# EAGLE design realtalker (EAGLE 7.1.0)
COMPANY_NAME: Mark J. Blair, NF6X; DOCUMENT_ID: CoCoEPROMpak_v1.0; REV: 1.0
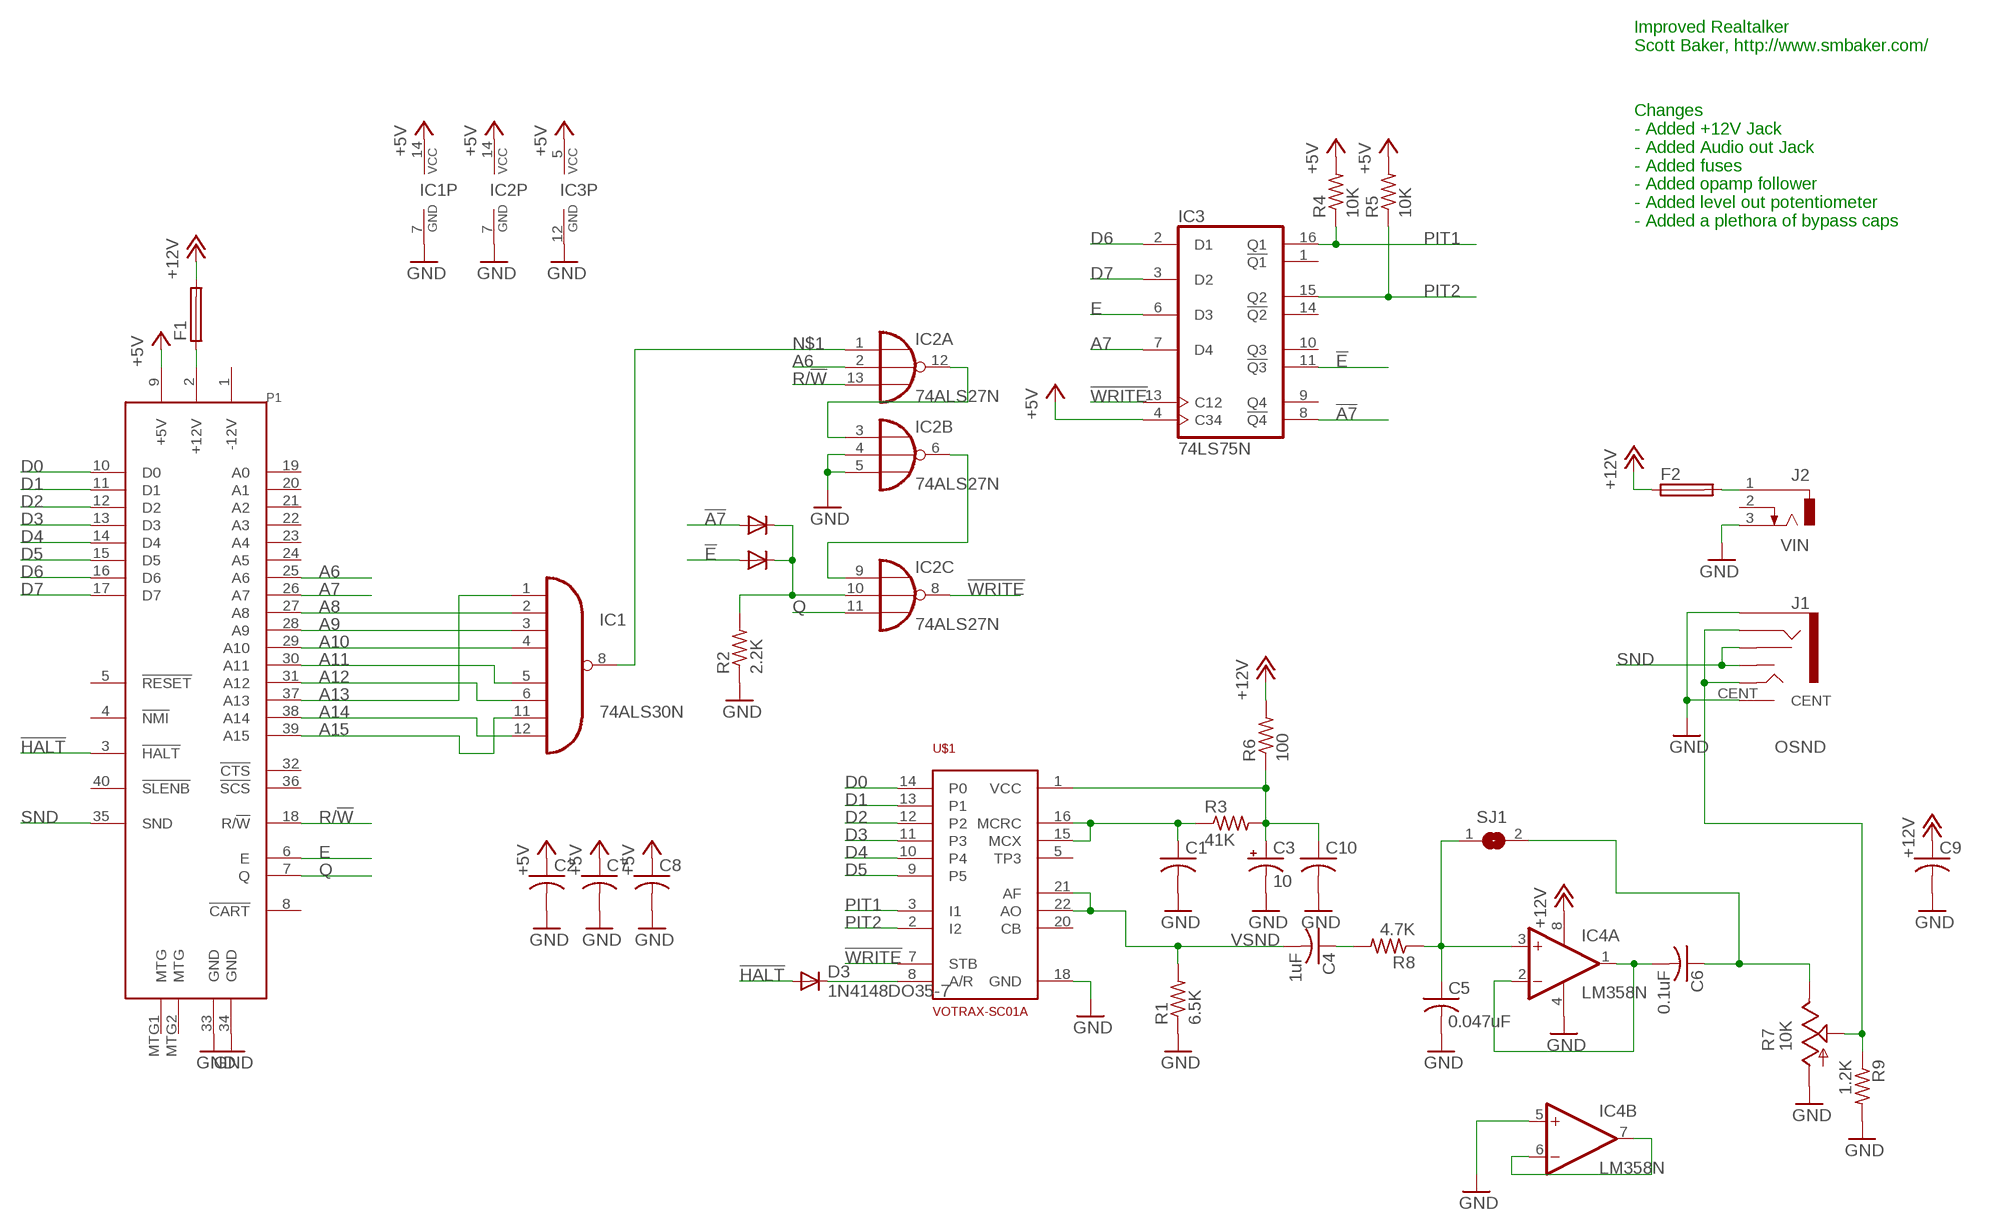
[diagram p0: schematic, sheet 1]

## Parts
C1  C-US025-025X050  [C025-025X050]
C2  C-US025-025X050  [C025-025X050]
C3  10  CPOL-USE2.5-6  [E2,5-6]
C4  1uF  C-US025-025X050  [C025-025X050]
C5  0.047uF  C-US025-025X050  [C025-025X050]
C6  0.1uF  C-US025-025X050  [C025-025X050]
C7  C-US025-025X050  [C025-025X050]
C8  C-US025-025X050  [C025-025X050]
C9  C-US025-025X050  [C025-025X050]
C10  C-US025-025X050  [C025-025X050]
D1  1N4148DO35-7  [DO35-7]
D2  1N4148DO35-7  [DO35-7]
D3  1N4148DO35-7  [DO35-7]
F1  PTC_FUSE  [PTC_0.400]
F2  PTC_FUSE  [PTC_0.400]
IC1  74ALS30N  [DIL14]
IC2  74ALS27N  [DIL14]
IC3  74LS75N  [DIL16]
IC4  LM358N  [DIL08]
J1  AUDIO_JACK_3.5MM  [AUDIO-JACK-G]
J2  VIN  DCJACK  [DCJACK]
P1  COCO-CARTMED  [COCO-CART_MEDIUM]
R1  6.5K  R-US_0204/7  [0204/7]
R2  2.2K  R-US_0204/7  [0204/7]
R3  41K  R-US_0204/7  [0204/7]
R4  10K  R-US_0204/7  [0204/7]
R5  10K  R-US_0204/7  [0204/7]
R6  100  R-US_0204/7  [0204/7]
R7  10K  TRIM_US-CT6  [CT6]
R8  4.7K  R-US_0204/7  [0204/7]
R9  1.2K  R-US_0204/7  [0204/7]
SJ1  SJ  [SJ]
U$1  VOTRAX-SC01A  [DIL22-4]

## Nets
!A7: D2.A IC3.8(!Q4)
!E: D1.A IC3.11(!Q3)
!HALT: D3.A P1.3(!HALT)
!WRITE: IC2.8(C:O) IC3.13(C12) U$1.7(STB)
+5V: C2.1 C7.1 C8.1 IC1.14(VCC) IC2.14(P:VCC) IC3.4(C34) IC3.5(VCC) P1.9(+5V) R4.2 R5.2
+12V [PWR]: C9.1 F1.2 F2.1 IC4.8(P:V+) R6.2
A6: IC2.2(A:I1) P1.25(A6)
A7: IC3.7(D4) P1.26(A7)
A8: IC1.2(I1) P1.27(A8)
A9: IC1.3(I2) P1.28(A9)
A10: IC1.4(I3) P1.29(A10)
A11: IC1.5(I4) P1.30(A11)
A12: IC1.6(I5) P1.31(A12)
A13: IC1.1(I0) P1.37(A13)
A14: IC1.12(I7) P1.38(A14)
A15: IC1.11(I6) P1.39(A15)
D0: P1.10(D0) U$1.14(P0)
D1: P1.11(D1) U$1.13(P1)
D2: P1.12(D2) U$1.12(P2)
D3: P1.13(D3) U$1.11(P3)
D4: P1.14(D4) U$1.10(P4)
D5: P1.15(D5) U$1.9(P5)
D6: IC3.2(D1) P1.16(D6)
D7: IC3.3(D2) P1.17(D7)
E: IC3.6(D3) P1.6(E)
GND [PWR]: C1.2 C2.2 C3.- C5.2 C7.2 C8.2 C9.2 C10.2 IC1.7(GND) IC2.4(B:I1) IC2.5(B:I2) IC2.7(P:GND) IC3.12(GND) IC4.4(P:V-) IC4.5(B:+IN) J1.CENT J1.SLEEVE J2.3 P1.33(GND) P1.34(GND) R1.1 R2.1 R7.A R9.2 U$1.18(GND)
N$1: IC1.8(O) IC2.1(A:I0)
N$2: D3.C U$1.8(A/R)
N$3: C1.1 R3.1 U$1.15(MCX) U$1.16(MCRC)
N$4: C5.1 IC4.3(A:+IN) R8.1 SJ1.1
N$5 [PWR]: C3.+ C10.1 R3.2 R6.1 U$1.1(VCC)
N$6: IC2.3(B:I0) IC2.12(A:O)
N$7: IC2.6(B:O) IC2.9(C:I0)
N$8: D1.C D2.C IC2.10(C:I1) R2.2
N$9: C4.1 R8.2
N$10: IC4.6(B:-IN) IC4.7(B:OUT)
N$11: C6.1 R7.E SJ1.2
N$12 [PWR]: F2.2 J2.1
N$13 [PWR]: F1.1 P1.2(+12V)
N$49: C6.2 IC4.1(A:OUT) IC4.2(A:-IN)
OSND: J1.RING J1.TIP R7.S R9.1
PIT1: IC3.16(Q1) R4.1 U$1.3(I1)
PIT2: IC3.15(Q2) R5.1 U$1.2(I2)
Q: IC2.11(C:I2) P1.7(Q)
R/!W: IC2.13(A:I2) P1.18(R/!W)
SND: J1.RSH J1.TSH P1.35(SND)
VSND: C4.2 R1.2 U$1.21(AF) U$1.22(AO)
Unconnected: IC3.1(!Q1) IC3.9(Q4) IC3.10(Q3) IC3.14(!Q2) J2.2 P1.1(-12V) P1.4(!NMI) P1.5(!RESET) P1.8(!CART) P1.19(A0) P1.20(A1) P1.21(A2) P1.22(A3) P1.23(A4) P1.24(A5) P1.32(!CTS) P1.36(!SCS) P1.40(!SLENB) P1.MTG1(MTG) P1.MTG2(MTG) U$1.5(TP3) U$1.20(CB)

## Notes on the sheet
- Improved Realtalker
  Scott Baker, http://www.smbaker.com/
- Changes
  - Added +12V Jack
  - Added Audio out Jack
  - Added fuses
  - Added opamp follower
  - Added level out potentiometer
  - Added a plethora of bypass caps

## Library data of the parts
C1 C2 C4-C10 = resistor:C-US: CAPACITOR, American symbol
C3 = resistor:CPOL-US: POLARIZED CAPACITOR, American symbol
D1-D3 = diode:1N4148: DIODE high speed (Philips)
F1 F2 = scott:PTC_FUSE: PICOFUSE 19275, Wickmann; OC_FARNELL: unknown; OC_NEWARK: unknown
IC1 = 74xx-eu:74*30: 8-input NAND gate
IC2 = 74xx-eu:74*27: Triple 3-input NOR gate
IC3 = 74xx-eu:74*75: 4-bit bistable LATCH
IC4 = linear:LM358: OP AMP also LM158; LM258; LM2904 Source: http://cache.national.com/ds/LM/LM158.pdf
J1 = scott:AUDIO_JACK_3.5MM: Audio Jack 3.5mm variants of PTH and SMT stereo audio jack with bypass switches. SparkFun Products: SparkFun SparkPunk Sound Kit <[https://www.sparkfun.com/products/11177]> - PTH MP3 Trigger <https://www.sparkfun.com/products/13720> -3.5mm SMD SparkFun PicoBoard <https://www.sparkfun.com/products/11888>- 2.5mm SMD
J2 = scott:DCJACK: DC POWER JACK Source: DCJ0202.pdf
P1 = scott:COCO-CART: Tandy/TRS-80 Color Computer Cartridge Connector
R1-R6 R8 R9 = resistor:R-US_: RESISTOR, American symbol
R7 = pot:TRIM_US-: POTENTIOMETER
SJ1 = jumper:SJ: SMD solder JUMPER
U$1 = scott:VOTRAX-SC01A

## Net classes
0 default: width 0.254 mm, drill 0.254 mm
1 PWR: width 0.406 mm, clearance 0.254 mm

## Board
CoCoEPROMpak 4k-64k EPROM-based ROM cartridge for the Tandy/TRS-80 Color Computer. Copyright 2013 Mark J. Blair Distributed under GPLv3 https://github.com/NF6X/CoCoEPROMpak CoCoEPROMpak is a free hardware design: you can redistribute it and/or modify it under the terms of the GNU General Public License as published by the Free Software Foundation, either version 3 of the License, or (at your option) any later version. CoCoEPROMpak is distributed in the hope that it will be useful, but WITHOUT ANY WARRANTY; without even the implied warranty of MERCHANTABILITY or FITNESS FOR A PARTICULAR PURPOSE. See the GNU General Public License for more details. You should have received a copy of the GNU General Public License along with CoCoEPROMpak. If not, see .
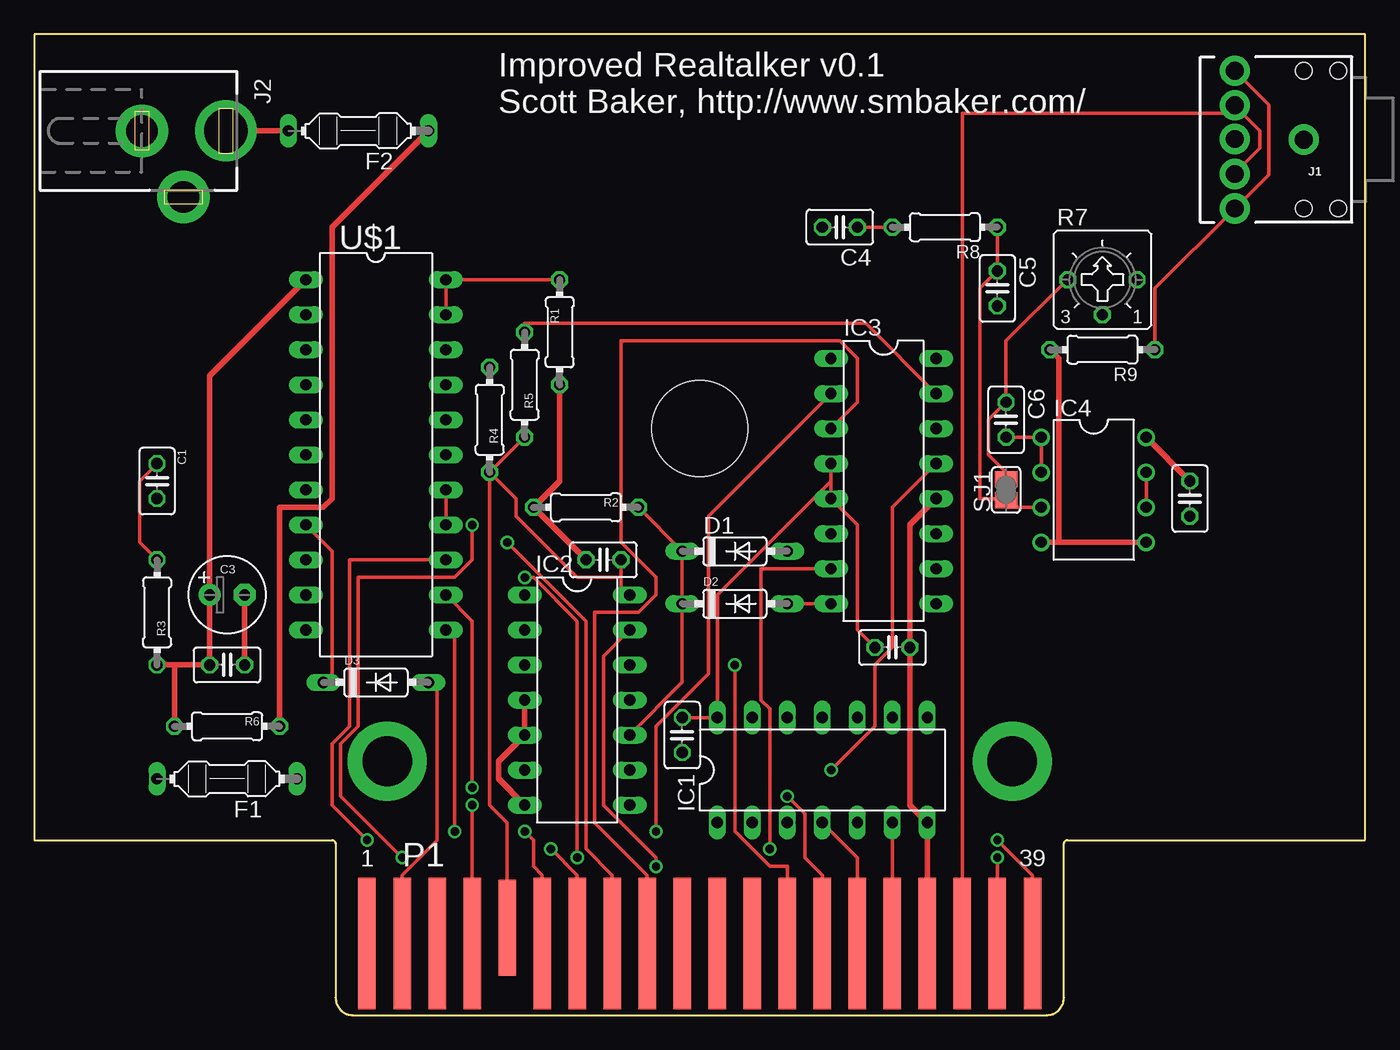
[diagram p1: board, top side]
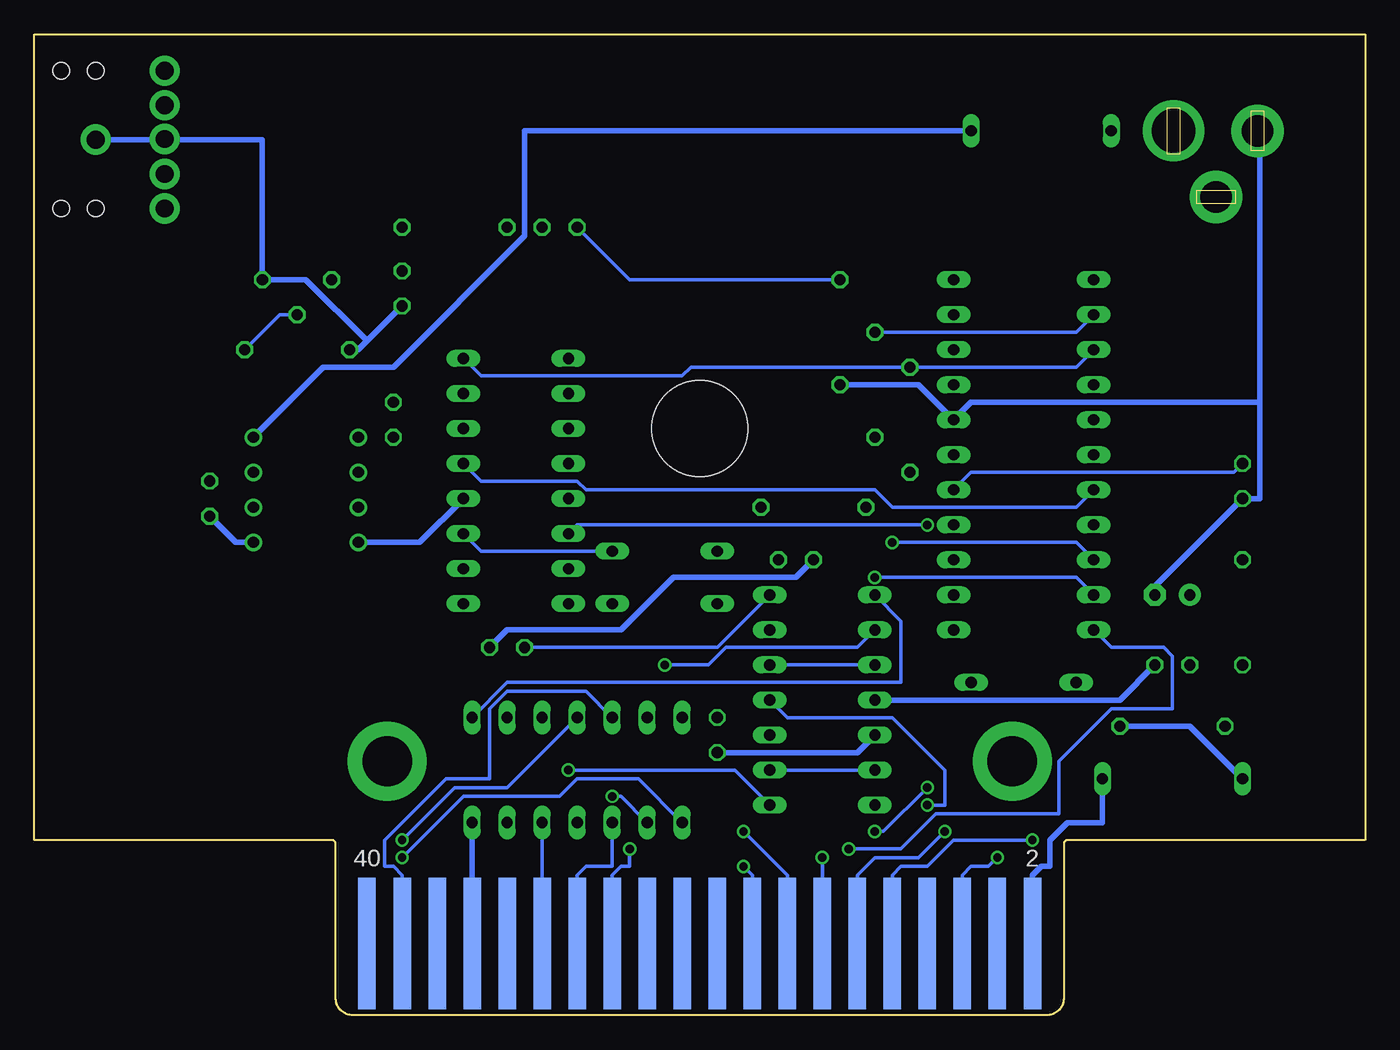
[diagram p2: board, bottom side, seen from below]

Size 96.52 x 71.12 mm. Coordinates in mm from the lower left corner, seen from the top.
Copper layers (1*16): Top 0.0356mm / dielectric 1.5011mm / Bottom 0.0356mm
Design rules "LaenPCBOrder *": minimum track width 10mil, minimum drill 24mil, track to track 6mil, track to pad 6mil, pad to pad 6mil, via to via 6mil, smd to smd 6mil, copper to edge 15mil, drill to drill 6mil, minimum pad ring 7mil, minimum via ring 7mil, stop-mask expansion 3mil, vias tented up to drill 25mil, thermal gap 10mil

### Footprints (pad centres in the part's own frame; a part is rotated, then mirrored left to right if it is on the bottom)
C025-025X050 = drill 0.813 octagon: 1 -1.27,0; 2 1.27,0
E2,5-6 = drill 0.813 pad 1.6: + -1.27,0 | drill 0.813 pad 1.6 octagon: - 1.27,0
DO35-7 = drill 0.813 long: A 3.81,0; C -3.81,0
PTC_0.400 = drill 0.813 long: 1 -5.08,0; 2 5.08,0
DIL14 = drill 0.813 long: 1 -7.62,-3.81; 2 -5.08,-3.81; 3 -2.54,-3.81; 4 0,-3.81; 5 2.54,-3.81; 6 5.08,-3.81; 7 7.62,-3.81; 8 7.62,3.81; 9 5.08,3.81; 10 2.54,3.81; 11 0,3.81; 12 -2.54,3.81; 13 -5.08,3.81; 14 -7.62,3.81
DIL16 = drill 0.813 long: 1 -8.89,-3.81; 2 -6.35,-3.81; 3 -3.81,-3.81; 4 -1.27,-3.81; 5 1.27,-3.81; 6 3.81,-3.81; 7 6.35,-3.81; 8 8.89,-3.81; 9 8.89,3.81; 10 6.35,3.81; 11 3.81,3.81; 12 1.27,3.81; 13 -1.27,3.81; 14 -3.81,3.81; 15 -6.35,3.81; 16 -8.89,3.81
DIL08 = drill 0.813 pad 1.27: 1 -3.81,-3.81; 2 -1.27,-3.81; 3 1.27,-3.81; 4 3.81,-3.81; 5 3.81,3.81; 6 1.27,3.81; 7 -1.27,3.81; 8 -3.81,3.81
AUDIO-JACK-G = drill 1.3 pad 2.184: CENT 5,-0.04; RING 5,5; RSH 5,2.5; SLEEVE 0,0; TIP 5,-5; TSH 5,-2.5 | hole 1.2: 0,5; -2.5,5; -2.5,-5; 0,-5
DCJACK = drill 3.175 pad 4.445: 1 0,3.1 | drill 2.286 pad 3.81: 2 4.8,0; 3 0,-3
COCO-CART_MEDIUM = smd 1.27 x 9.525: 1 -24.13,5.207; 3 -21.59,5.207; 5 -19.05,5.207; 7 -16.51,5.207; 11 -11.43,5.207; 13 -8.89,5.207; 15 -6.35,5.207; 17 -3.81,5.207; 19 -1.27,5.207; 21 1.27,5.207; 23 3.81,5.207; 25 6.35,5.207; 27 8.89,5.207; 29 11.43,5.207; 31 13.97,5.207; 33 16.51,5.207; 35 19.05,5.207; 37 21.59,5.207; 39 24.13,5.207 | smd 1.27 x 9.525 bottom: 2 -24.13,5.207; 4 -21.59,5.207; 6 -19.05,5.207; 8 -16.51,5.207; 10 -13.97,5.207; 12 -11.43,5.207; 14 -8.89,5.207; 16 -6.35,5.207; 18 -3.81,5.207; 20 -1.27,5.207; 22 1.27,5.207; 24 3.81,5.207; 26 6.35,5.207; 28 8.89,5.207; 30 11.43,5.207; 32 13.97,5.207; 34 16.51,5.207; 36 19.05,5.207; 38 21.59,5.207; 40 24.13,5.207 | smd 1.27 x 6.985: 9 -13.97,6.35 | drill 3.607 pad 5.715: MTG1 -22.669,18.415; MTG2 22.669,18.415 | hole 6.985: 0,42.545
0204/7 = drill 0.813 octagon: 1 -3.81,0; 2 3.81,0
CT6 = drill 0.813 octagon: A 2.515,0; E -2.515,0; S 0,-2.54
SJ = smd 1.168 x 1.6: 1 -0.762,0; 2 0.762,0
DIL22-4 = drill 0.813 long: 1 -12.7,-5.08; 2 -10.16,-5.08; 3 -7.62,-5.08; 4 -5.08,-5.08; 5 -2.54,-5.08; 6 0,-5.08; 7 2.54,-5.08; 8 5.08,-5.08; 9 7.62,-5.08; 10 10.16,-5.08; 11 12.7,-5.08; 12 12.7,5.08; 13 10.16,5.08; 14 7.62,5.08; 15 5.08,5.08; 16 2.54,5.08; 17 0,5.08; 18 -2.54,5.08; 19 -5.08,5.08; 20 -7.62,5.08; 21 -10.16,5.08; 22 -12.7,5.08

### Placement (x,y rotation side)
C1  8.89,38.73 270 top
C2  62.23,26.67 0 top
C3  13.97,30.48 0 top
C4  58.42,57.15 180 top
C5  69.85,52.7 270 top
C6  70.48,43.18 270 top
C7  41.27,33.02 180 top
C8  46.99,20.32 270 top
C9  83.82,37.47 270 top
C10  13.97,25.4 0 top
D1  50.8,33.66 0 top
D2  50.8,29.84 0 top
D3  24.76,24.13 0 top
F1  13.97,17.14 180 top
F2  23.49,64.14 180 top
IC1  57.15,17.78 0 top
IC2  39.37,22.86 270 top
IC3  61.59,38.73 270 top
IC4  76.84,38.1 270 top
J1  92.07,63.5 180 top
J2  10.79,64.14 270 top
P1  48.26,0 0 top
R1  38.1,49.53 90 top
R2  40,36.83 0 top
R3  8.89,29.21 270 top
R4  33.02,43.18 270 top
R5  35.56,45.72 270 top
R6  13.97,20.95 0 top
R7  77.47,53.34 0 top
R8  66.04,57.15 180 top
R9  77.47,48.26 180 top
SJ1  70.48,38.1 90 top
U$1  24.76,40.64 270 top

### Tracks (layer width: path | path; a pad name or v marks a point on that pad's centre or on a via)
!A7
  Top 0.254: IC3.8 D2.A
!E
  Bottom 0.254: D1.A 64.13,33.66 IC3.11
!HALT
  Top 0.254: D3.A 29.21,23.5 29.21,12.7 26.67,10.16 P1.3
!WRITE  (via drill 0.61)
  Top 0.254: v57.78,17.78 60.96,20.95 60.96,25.4 62.23,26.67 62.23,36.83 IC3.13
  Bottom 0.254: U$1.7 20.95,36.83 34.29,36.83 35.56,38.1 56.52,38.1 57.15,38.73 64.13,38.73 IC3.13 | IC2.8 45.72,17.78 v57.78,17.78
+5V
  Top 0.254: R5.2 R4.2 | IC2.14 42.54,31.11 42.54,31.75 | C7.1 42.54,31.75 | C8.1 IC1.14 49.53,30.48 57.78,38.73 | IC3.4 57.78,38.73 | 57.78,38.73 IC3.5 59.69,35.56 59.69,27.94 C2.1 | R4.2 34.92,37.47 34.92,36.2 39.37,31.75 42.54,31.75 | P1.9 34.29,13.97 33.02,15.24 R4.2
  Bottom 0.254: IC2.14 46.99,26.67 C2.1
+12V
  Top 0.406: IC4.8 C9.1 | F2.1 21.59,57.15 21.59,37.47 20.95,36.83 17.78,36.83 R6.2
  Bottom 0.406: F1.2 12.7,20.95 R6.2 | IC4.8 75.56,46.99 70.48,46.99 60.96,56.52 60.96,64.14 F2.1
A6  (via drill 0.61)
  Top 0.254: v50.8,25.4 50.8,13.34 53.34,10.79 54.61,10.79 P1.25
  Bottom 0.254: IC2.2 36.83,26.67 46.35,26.67 47.62,25.4 v50.8,25.4
A7  (via drill 0.61)
  Top 0.254: IC3.7 52.7,32.38 52.7,22.86 53.34,22.23 v53.34,12.06
  Bottom 0.254: v53.34,12.06 53.34,10.79 53.98,10.79 54.61,10.16 P1.26
A8  (via drill 0.61)
  Top 0.254: v54.61,15.88 55.88,14.61 55.88,11.43 57.15,10.16 P1.27
  Bottom 0.254: IC1.2 53.98,15.88 v54.61,15.88
A9
  Bottom 0.254: IC1.3 54.61,10.79 56.52,10.79 57.15,10.16 P1.28
A10
  Top 0.254: IC1.4 59.69,11.43 P1.29
A11
  Bottom 0.254: P1.30 IC1.5
A12
  Top 0.254: P1.31 IC1.6
A13  (via drill 0.61)
  Top 0.254: P1.37 v69.85,11.43
  Bottom 0.254: IC1.1 52.7,17.14 57.15,17.14 58.42,15.88 65.41,15.88 v69.85,11.43
A14
  Bottom 0.254: IC1.12 56.52,23.5 62.23,23.5 63.5,22.23 63.5,17.14 66.68,17.14 71.12,12.7 71.12,10.79 70.48,10.79 69.85,10.16 P1.38
A15  (via drill 0.61)
  Top 0.254: v69.85,12.7 72.39,10.16 P1.39
  Bottom 0.254: IC1.11 62.23,16.51 66.04,16.51 v69.85,12.7
D0  (via drill 0.61)
  Top 0.254: U$1.14 22.86,33.02 22.86,20.95 21.59,19.68 21.59,15.24 v24.13,12.7
  Bottom 0.254: v24.13,12.7 29.84,12.7 31.75,10.79 33.66,10.79 34.29,10.16 P1.10
D1  (via drill 0.61)
  Top 0.254: U$1.13 31.75,28.57 v31.75,16.51 | v35.56,13.34 36.2,12.7 36.2,10.79 36.83,10.16 P1.11
  Bottom 0.254: v31.75,16.51 34.92,13.34 v35.56,13.34
D2  (via drill 0.61)
  Top 0.254: U$1.12 30.48,27.3 v30.48,13.34
  Bottom 0.254: v30.48,13.34 32.38,11.43 35.56,11.43 36.83,10.16 P1.12
D3  (via drill 0.61)
  Top 0.254: v37.46,12.06 39.37,10.16 P1.13
  Bottom 0.254: U$1.11 18.41,26.67 14.6,26.67 13.97,26.04 13.97,22.23 18.41,22.23 22.22,18.41 22.22,14.61 31.11,14.61 33.66,12.06 v37.46,12.06
D4  (via drill 0.61)
  Top 0.254: v35.56,31.75 36.2,31.75 39.37,28.57 v39.37,11.43
  Bottom 0.254: U$1.10 20.95,31.75 v35.56,31.75 | P1.14 v39.37,11.43
D5  (via drill 0.61)
  Top 0.254: v34.29,34.29 40,28.57 40,12.06 41.91,10.16 P1.15
  Bottom 0.254: U$1.9 20.95,34.29 v34.29,34.29
D6  (via drill 0.61)
  Top 0.254: IC3.2 48.89,36.2 48.89,24.77 45.09,20.95 v45.09,13.34
  Bottom 0.254: v45.09,13.34 41.91,10.16 P1.16
D7
  Top 0.254: IC3.3 59.69,44.45 59.69,47.62 58.42,48.9 42.54,48.9 42.54,34.29 45.09,31.75 45.09,30.48 43.81,29.21 40.64,29.21 40.64,13.97 44.45,10.16 P1.17
E  (via drill 0.61)
  Top 0.254: v31.75,35.56 31.75,33.02 30.48,31.75 23.49,31.75 23.49,20.95 22.22,19.68 22.22,15.88 v26.67,11.43
  Bottom 0.254: IC3.6 57.15,35.56 v31.75,35.56 | v26.67,11.43 27.3,10.79 28.57,10.79 29.21,10.16 P1.6
GND
  Top 0.406: C7.2 R2.1 38.1,38.73 R1.1 | IC2.7 33.66,17.14 33.66,18.41 IC2.5 IC2.4 | C3.- C10.2 | P1.34 IC1.7 63.5,15.24 C2.2 63.5,35.56 IC3.12 | IC4.5 74.29,34.29 | 74.29,34.29 IC4.4 | R9.2 74.29,47.62 74.29,34.29
  Bottom 0.406: R1.1 32.38,45.72 U$1.18 28.57,44.45 7.62,44.45 | C8.2 36.83,19.05 IC2.5 | C3.- 15.24,31.11 C1.2 7.62,37.47 7.62,44.45 | 7.62,44.45 7.62,64.14 J2.3 | IC2.4 17.78,22.86 C10.2 | 72.39,48.9 73.03,48.26 R9.2 | 72.39,48.9 C5.2 | J1.SLEEVE 87.63,63.5 J1.CENT 87,63.5 80.01,63.5 80.01,53.34 R7.A 76.84,53.34 72.39,48.9 | IC1.7 P1.34 | C9.2 81.91,34.29 IC4.5 | IC3.12 68.58,34.29 IC4.4 | C7.2 41.27,31.75 50.16,31.75 53.98,27.94 62.23,27.94 C2.2
N$1
  Bottom 0.254: IC2.1 33.66,28.57 33.66,24.13 62.23,24.13 IC1.8
N$2
  Top 0.254: D3.C 21.59,24.77 21.59,33.66 U$1.8
N$3
  Top 0.254: U$1.16 U$1.15 | R3.1 7.62,34.29 7.62,38.73 C1.1
  Bottom 0.254: U$1.16 28.57,39.37 9.52,39.37 C1.1
N$4
  Top 0.254: IC4.3 70.48,36.83 SJ1.1 70.48,37.47 68.58,37.47 68.58,52.7 C5.1 R8.1
N$5
  Top 0.406: 10.16,25.4 C10.1 C3.+ 12.7,46.35 U$1.1 | 10.16,25.4 R3.2 | 10.16,25.4 R6.1
N$6
  Bottom 0.254: IC2.12 IC2.3
N$7
  Bottom 0.254: IC2.9 IC2.6
N$8
  Top 0.254: IC2.10 46.99,24.13 D2.C D1.C R2.2
N$9
  Top 0.254: R8.2 C4.1
N$10
  Top 0.254: IC4.7 IC4.6
N$11
  Top 0.254: SJ1.2 70.48,39.37 69.22,40.64 69.22,43.18 C6.1 70.48,48.9 74.93,53.34 R7.E
N$12
  Top 0.406: J2.1 F2.2
N$13
  Bottom 0.406: F1.1 19.05,13.97 21.59,13.97 22.86,12.7 22.86,10.79 23.49,10.79 24.13,10.16 P1.2
N$49
  Top 0.254: C6.2 IC4.1 IC4.2
OSND
  Top 0.254: R9.1 81.28,52.7 J1.RING 89.53,60.96 89.53,66.04 J1.TIP
  Bottom 0.254: R9.1 78.74,50.8 R7.S
PIT1
  Bottom 0.254: U$1.3 20.95,46.99 R4.1 48.89,46.99 49.53,46.35 64.13,46.35 IC3.16
PIT2
  Top 0.254: IC3.15 60.32,50.16 35.56,50.16 R5.1
  Bottom 0.254: U$1.2 20.95,49.53 R5.1
Q  (via drill 0.61)
  Top 0.254: P1.7 v31.75,15.24
  Bottom 0.254: IC2.11 41.91,21.59 34.29,21.59 30.48,17.78 30.48,15.24 v31.75,15.24
R/!W  (via drill 0.61)
  Top 0.254: IC2.13 41.27,26.04 41.27,15.24 45.09,11.43 v45.09,10.79
  Bottom 0.254: v45.09,10.79 44.45,10.16 P1.18
SND
  Top 0.254: J1.RSH 87.63,61.59 88.9,62.87 88.9,64.14 87.63,65.41 J1.TSH 87,65.41 67.31,65.41 P1.35
VSND
  Top 0.254: U$1.21 U$1.22 R1.2
  Bottom 0.254: C4.2 53.34,53.34 R1.2

### Text on the board
tPlace: Improved Realtalker v0.1 / Scott Baker, http://www.smbaker.com/